# Altium schematic sheet Sheet1.SchDoc
size B; SheetNumber: 1; SheetTotal: 1
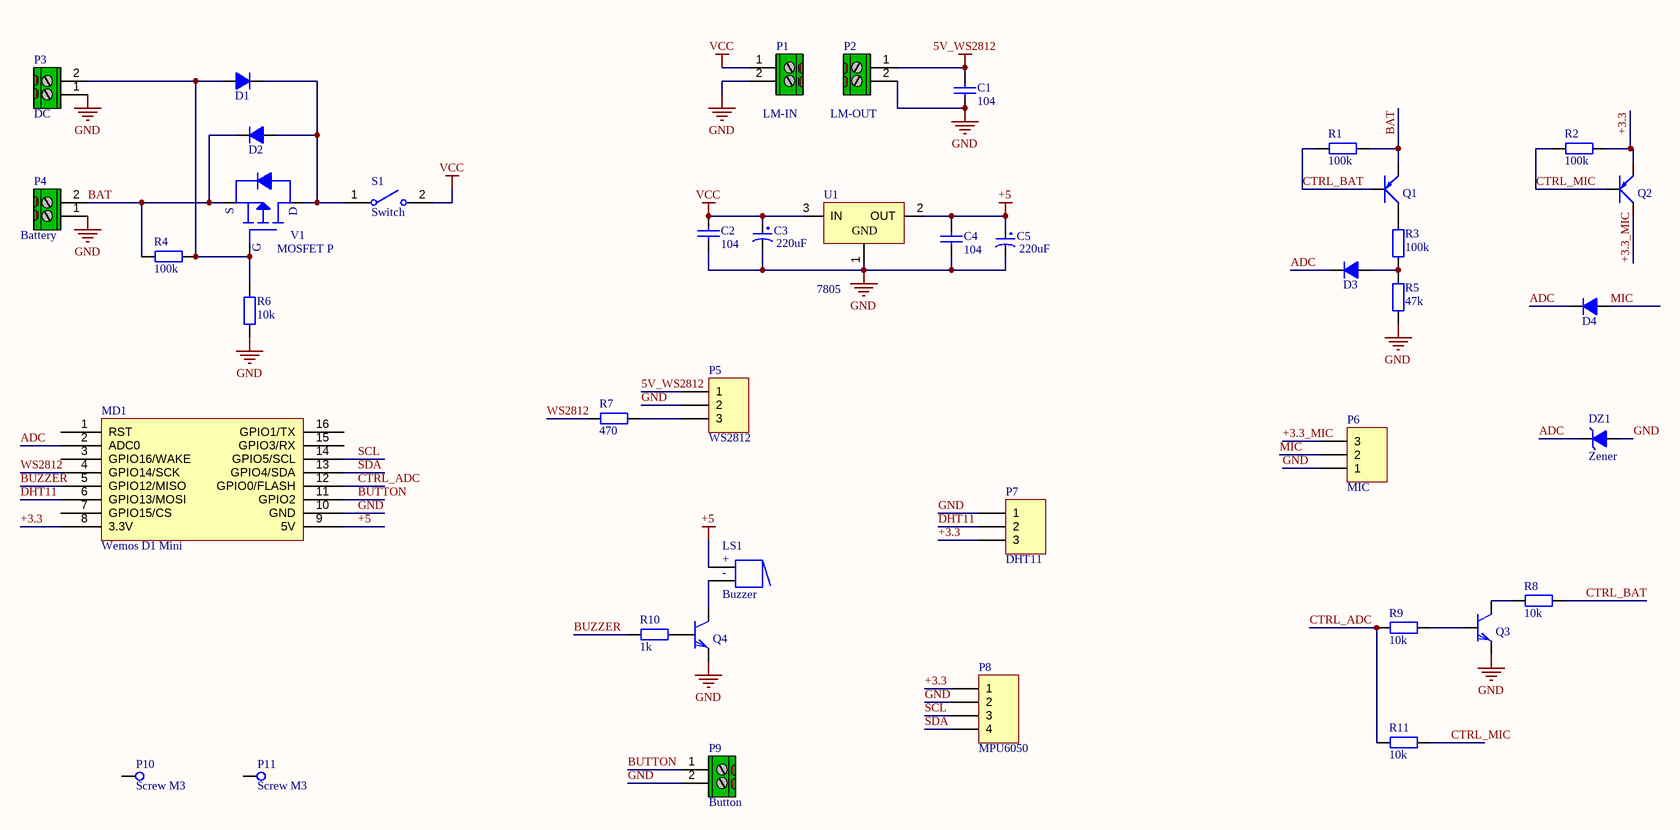
[diagram p0: Sheet1.SchDoc]

## Parts
C1  104  [CAP [0805]]
C2  104  [CAP [0805]]
C3  220uF  [TU HOA 8mm]
C4  104  [CAP [0805]]
C5  220uF  [TU HOA 8mm]
D1  Diode  [DIODE 10.5MM]  (value not drawn)
D2  Diode  [DIODE 10.5MM]  (value not drawn)
D3  Diode  [DIODE SMD 5.5MM]  (value not drawn)
D4  Diode  [DIODE SMD 5.5MM]  (value not drawn)
DZ1  Zener  [DIODE SMD 3.8MM]
LS1  Buzzer  [Buzzer sounder 14mm]
MD1  Wemos D1 Mini  [Wemos D1 Mini]
P1  LM-IN  [TEST PAD - medium]
P2  LM-OUT  [TEST PAD - medium]
P3  DC  [TEST PAD - medium]
P4  Battery  [TEST PAD - medium]
P5  WS2812  [Header3]
P6  MIC  [Header3]
P7  DHT11  [Header3]
P8  MPU6050  [Header4]
P9  Button  [Header2]
P10  Screw M3  [JP SCREW M3x10]
P11  Screw M3  [JP SCREW M3x10]
Q1  A1015  [SOT23]  (value not drawn)
Q2  A1015  [SOT23]  (value not drawn)
Q3  C1815  [SOT23]  (value not drawn)
Q4  C1815  [SOT23]  (value not drawn)
R1  100k  [RES [0805]]
R2  100k  [RES [0805]]
R3  100k  [RES [0805]]
R4  100k  [RES [0805]]
R5  47k  [RES [0805]]
R6  10k  [RES [0805]]
R7  470  [RES [0805]]
R8  10k  [RES [0805]]
R9  10k  [RES [0805]]
R10  1k  [RES [0805]]
R11  10k  [RES [0805]]
S1  Switch  [TEST PAD - medium]
U1  7805  [TO252 SMD]
V1  MOSFET P  [TO252 SMD]

## Nets
5V_WS2812: C1.2 P2.1 P5.1
+5: C4.2 C5.1 LS1.1(+) MD1.9(5V) U1.2(OUT)
GND: C1.1 C2.1 C3.2 C4.1 C5.2 DZ1.1(A) MD1.10(GND) P1.2 P2.2 P3.1 P4.1 P5.2 P6.1 P7.1 P8.2 P9.2 Q3.2(E) Q4.2(E) R5.1 R6.1 U1.1(GND)
VCC: C2.2 C3.1 P1.1 S1.2 U1.3(IN)
+3.3: MD1.8(3.3V) P7.3 P8.1 Q2.2(E) R2.2
+3.3_MIC: P6.3 Q2.3(C)
ADC: D3.2(K) D4.2(K) DZ1.2(K) MD1.2(ADC0)
BAT: D2.2(K) P4.2 Q1.2(E) R1.2 R4.1 V1.3(S)
BUTTON: MD1.11(GPIO2) P9.1
BUZZER: MD1.5(GPIO12/MISO) R10.1
CTRL_ADC: MD1.12(GPIO0/FLASH) R9.2 R11.2
CTRL_BAT: Q1.1(B) R1.1 R8.1
CTRL_MIC: Q2.1(B) R2.1 R11.1
DHT11: MD1.6(GPIO13/MOSI) P7.2
MIC: D4.1(A) P6.2
SCL: MD1.14(GPIO5/SCL) P8.3
SDA: MD1.13(GPIO4/SDA) P8.4
WS2812: MD1.4(GPIO14/SCK) R7.1
NetD1_1: D1.1(A) P3.2 R4.2 R6.2 V1.1(G)
NetD1_2: D1.2(K) D2.1(A) S1.1 V1.2(D)
NetD3_1: D3.1(A) R3.1 R5.2
NetLS1_2: LS1.2 Q4.3(C)
NetP5_3: P5.3 R7.2
NetQ1_3: Q1.3(C) R3.2
NetQ3_1: Q3.1(B) R9.1
NetQ3_3: Q3.3(C) R8.2
NetQ4_1: Q4.1(B) R10.2

Not connected (* = marked no-connect by the designer): MD1 1(RST) 3(GPIO16/WAKE) 7(GPIO15/CS) 15(GPIO3/RX) 16(GPIO1/TX); P10 1(CP); P11 1(CP)

## Notes on the sheet
- DWG NO:
- REV:
- THIS DOCUMENT AND THE DATA DISCLOSED HEREIN OR
- HEREWITH IS THE PROPERTY OF ALTIUM LIMITED AND MAY
- BE FREELY DISTRIBUTED IN WHOLE. NO RIGHTS ARE
- RESERVED OR EXPRESS OR IMPLIED WARANTEE GIVEN.
- REVISION
- DESCRIPTION
- DATE
- APPROVED
- ENG:
- APPROVALS
- PROJECT
- DSN:
- CHK:
- REFERENCE DOCUMENTS
- PROJECT REVISION:
- TITLE
- DOCUMENT REVISION:
- DESIGN ITEM:
- BOM:
- FAB DWG:
- PCB DWG:
- ASSY DWG:
- SCALE:
- A2
- SIZE
- CAGE CODE
- FILE NAME
- DWG NO.
- SHEET
- OF
- REV
- (in symbol Buzzer) -

## Library data of the parts
C1 C2 C4 = Tu: Cap; Ten_Linh_Kien: Tụ 0805 102-1nF 10% 50V; Ma_Hang: MH004549; Don_Vi: Con; Chung_Loai: Dán; Kieu_Chan: *; Ghi_Chu: *
C3 C5 = TU HOA: dip; Chung_Loai: Cắm; Don_Vi: Con; So_Chan: 2; Ten_Linh_Kien: Tụ Hóa 680uF 25V; Ma_Hang: MH005082; Kieu_Chan: *
D1-D4 = Diode: Vendor: Digikey; Value: FRxxx; Published: 8-Jun-2000; LatestRevisionDate: 17-Jul-2002; LatestRevisionNote: Re-released for DXP Platform.; DatasheetDocument: 1997; PackageReference: DO-35; Publisher: Altium Limited; Code_JEDEC: DO-204-AH; ComponentLink1Description: Digikey Part Link; ComponentLink1URL: http://www.fairchildsemi.com/; ComponentLink2Description: Open Datasheet; ComponentLink2URL: H:\LIBRARY\LIBRARY.Datasheet\ds26003.pdf
LS1 = Buzzer: Magnetic Transducer Buzzer; Published: 24-Mar-1999; LatestRevisionDate: 17-Dec-2003; LatestRevisionNote: Schematic revised, PCB Footprint replaced.; DatasheetDocument: 17-Dec-2003; PackageReference: ABSM-1574; Publisher: Altium Limited; ComponentLink1Description: Manufacturer Link; ComponentLink1URL: http://www.megastar.com/linecard/buzzmode/index.php
P1-P4 P9 = CON2: Header, 2-Pin; LatestRevisionDate: 17-Jul-2002; LatestRevisionNote: Re-released for DXP Platform.; Publisher: Altium Limited
P5-P7 = CON3: Header, 3-Pin; LatestRevisionDate: 17-Jul-2002; LatestRevisionNote: Re-released for DXP Platform.; Publisher: Altium Limited
P8 = CON4: Header, 4-Pin; LatestRevisionDate: 17-Jul-2002; LatestRevisionNote: Re-released for DXP Platform.; Publisher: Altium Limited
P10 P11 = CON1: Connect Pad, 1-Pin; LatestRevisionDate: 17-Jul-2002; LatestRevisionNote: Re-released for DXP Platform.; Publisher: Altium Limited
Q1 Q2 = A1015 SMD: COMPONENT: 2SA1015; PSpiceTemplate: Q^@REFDES %c %b %e @MODEL; Vendor: Digikey; VCBO: -50V; VEBO: -5V; Ic: 150mA; Pc: 200mW; Published: 13-April-2009; Publisher: Hoang Nguyen; Price: 500VND; VCEO: -50V
Q3 Q4 = C1815 SMD: Publisher: Viet Kynl
R1-R11 = Tro: Resistor; Chung_Loai: Cắm; Don_Vi: Con; So_Chan: 2; Kieu_Chan: *
U1 = 7805: 3-Terminal 1A Positive Voltage Regulator
V1 = MOSFET P: P-CHANNEL POWER MOSFETS; Vendor: Digikey; Publisher: Hoang Nguyen; Price: 7.000 VND; ComponentLink2Description: Open Datasheet; ComponentLink2URL: H:\LIBRARY\LIBRARY.Datasheet\IRF9540.pdf; Published: 13-April-2009; ComponentLink1Description: Digikey Part Link
S1 = Switch: Published: 24-Mar-1999; LatestRevisionDate: 17-Dec-2003; LatestRevisionNote: Schematic revised, PCB Footprint replaced.; DatasheetDocument: 05-Dec-2000; PackageReference: TL36WW15050; Publisher: Altium Limited; ComponentLink1Description: Manufacturer Link; ComponentLink1URL: http://www.apem.com